# EAGLE design AmbaSat-03-BME680 (EAGLE 9.3.2)
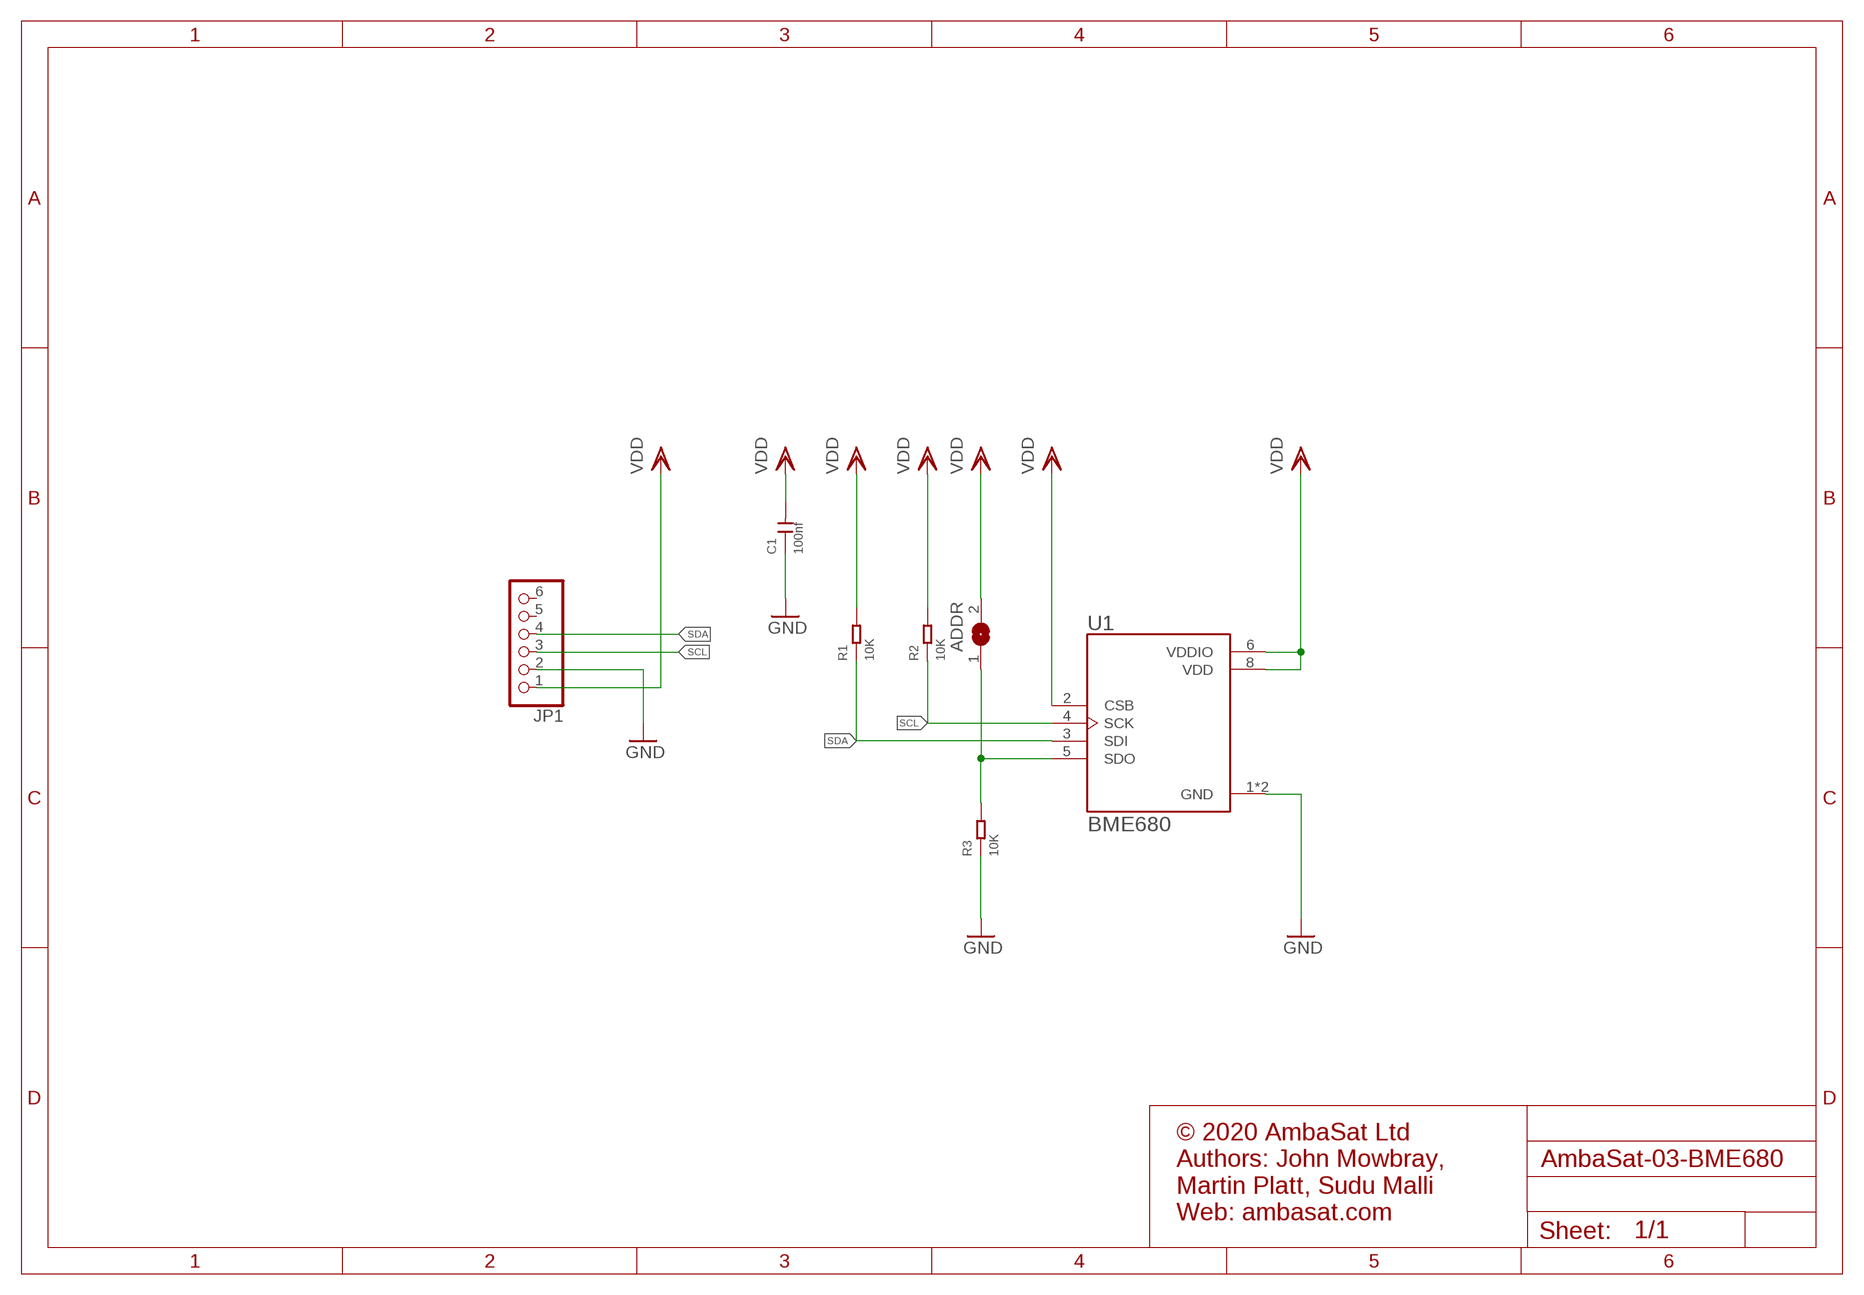
[diagram p0: schematic, sheet 1]

## Parts
ADDR  SJ  [SJ]
C1  100nf  CERAMIC-100NF-50V-10%-X7R(0805)  [C0805]
JP1  HEADER-1X6  [1X06_OVAL]
R1  10K  SMD-RES-10K-1%-1/8W(0805)  [R0805]
R2  10K  SMD-RES-10K-1%-1/8W(0805)  [R0805]
R3  10K  SMD-RES-10K-1%-1/8W(0805)  [R0805]
U1  BME680  [PSON80P300X300X100-8N]

## Nets
GND: C1.1 JP1.2 R3.1 U1.1(GND) U1.7(GND)
N$3: ADDR.1 R3.2 U1.5(SDO)
SCL: JP1.3 R2.1 U1.4(SCK)
SDA: JP1.4 R1.1 U1.3(SDI)
VDD: ADDR.2 C1.2 JP1.1 R1.2 R2.2 U1.2(CSB) U1.6(VDDIO) U1.8(VDD)
Unconnected: JP1.5 JP1.6

## Notes on the sheet
- © 2020 AmbaSat Ltd
  Authors: John Mowbray, 
  Martin Platt, Sudu Malli
  Web: ambasat.com

## Library data of the parts
ADDR = jumper:SJ: SMD solder JUMPER
C1 = Seeed-Capacitor:CERAMIC-100NF-50V-10%-X7R(0805): 302010165; MPN: CC0805KRX7R9BB104
JP1 = microbuilder:HEADER-1X6: PIN HEADER
R1-R3 = Seeed-Resistor:SMD-RES-10K-1%-1/8W(0805): 301010361; MPN: RC0805FR-0710KL
U1 = BME680:BME680: Integrated Environmental Unit; AVAILABILITY: Unavailable; DESCRIPTION: Integrated Environmental Unit; MF: Bosch Sensortec; MP: BME680; PACKAGE: LGA-8 Bosch Tools; PRICE: None

## Board
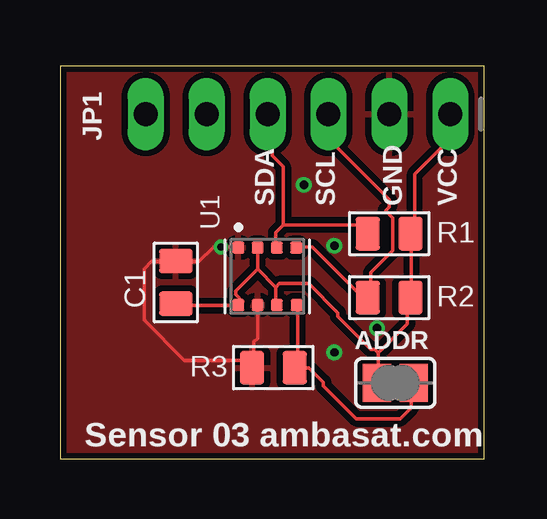
[diagram p1: board, top side]
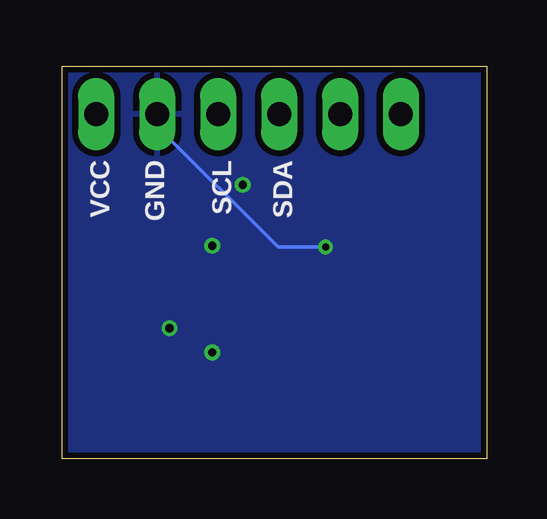
[diagram p2: board, bottom side, seen from below]

Size 17.68 x 16.38 mm. Coordinates in mm from the lower left corner, seen from the top.
Outline: 0,0 17.68,0 17.68,16.38 0,16.38 0,0
Copper layers (1*16): Top 0.035mm / dielectric 1.5mm / Bottom 0.035mm
Design rules "SeeedStudio_2layer_DRU_no_angle_20140221": minimum track width 6mil, minimum drill 12mil, track to track 6mil, track to pad 6mil, pad to pad 6mil, via to via 6mil, smd to smd 0mil, copper to edge 10mil, drill to drill 10mil, minimum pad ring 10mil, minimum via ring 6mil, stop-mask expansion 2mil, vias tented up to drill 100mil, thermal gap 10mil

### Footprints (pad centres in the part's own frame; a part is rotated, then mirrored left to right if it is on the bottom)
SJ = smd 1.168 x 1.6: 1 -0.762,0; 2 0.762,0
C0805 = smd 1.397 x 1.016: 1 0,0.889; 2 0,-0.889
1X06_OVAL = drill 1 long: 1 -6.35,0; 2 -3.81,0; 3 -1.27,0; 4 1.27,0; 5 3.81,0; 6 6.35,0
R0805 = smd 1.397 x 1.016: 1 0,0.889; 2 0,-0.889
PSON80P300X300X100-8N = smd 0.5 x 0.5: 1 1.2,1.2; 2 1.2,0.4; 3 1.2,-0.4; 4 1.2,-1.2; 5 -1.2,-1.22; 6 -1.2,-0.4; 7 -1.2,0.4; 8 -1.2,1.2

### Placement (x,y rotation side)
ADDR  13.97,3.17 180 top
C1  4.83,7.37 0 top
JP1  9.92,14.38 180 top
R1  13.72,9.4 90 top
R2  13.72,6.73 90 top
R3  8.89,3.81 90 top
U1  8.64,7.62 90 top

### Tracks (layer width: path | path; a pad name or v marks a point on that pad's centre or on a via)
GND  (via drill 0.3, 0.35)
  Top 0.152: U1.1 7.32,8.84 v6.71,8.84 6.4,8.84 5.79,8.23 4.88,8.23 C1.1 4.72,8.23 3.81,8.23 3.5,7.92 3.5,5.79 5.18,4.12 8.08,4.12 | 8.08,4.12 8.08,3.81 R3.1 8.08,4.12 | 8.08,4.12 8.08,4.88 8.23,5.03 8.23,6.4 U1.7
  Bottom 0.152: v6.71,8.84 8.69,8.84 13.72,13.87 13.72,14.33 JP1.2
  other vias: 10.16,11.43 11.43,8.89 11.43,4.45 13.21,5.46
  pour Bottom (isolate 0.254): 0,16.38 0,0 17.68,0 17.68,16.38
  pour Top (isolate 0.254): 0,16.38 0,0 17.68,0 17.68,16.38
N$3
  Top 0.152: 9.91,3.81 9.91,6.4 U1.5 | 9.91,3.81 10.36,3.81 10.97,3.2 10.97,3.05 12.34,1.68 14.17,1.68 14.63,2.13 14.63,3.05 ADDR.1 | 9.91,3.81 R3.2
SCL
  Top 0.152: U1.4 9.91,8.84 10.52,8.84 12.5,6.86 12.8,6.86 R2.1 12.95,6.86 12.95,7.77 13.87,8.69 13.87,10.06 13.56,10.36 13.72,10.52 13.72,10.82 11.28,13.26 11.28,14.33 JP1.3
SDA
  Top 0.152: 9.3,9.75 8.99,9.45 8.99,8.84 U1.3 | 9.3,9.75 12.5,9.75 12.8,9.45 R1.1 | 9.3,9.75 9.3,12.19 8.84,12.65 8.84,12.8 8.69,12.95 8.69,14.33 JP1.4
VDD
  Top 0.152: C1.2 4.88,6.4 7.32,6.4 U1.8 7.47,6.4 7.62,6.55 7.32,6.86 7.32,7.01 8.23,7.92 | 8.23,7.92 8.23,8.69 U1.2 | 8.99,7.16 8.99,6.55 U1.6 | 8.23,7.92 8.99,7.16 | 13.26,4.42 13.26,3.2 ADDR.2 | 13.26,4.42 14.48,5.64 14.48,6.71 R2.2 14.63,6.86 14.63,9.3 R1.2 14.63,9.45 14.78,9.6 14.78,11.89 16.15,13.26 16.15,14.33 JP1.1 | 8.99,7.16 9.14,7.32 10.36,7.32 11.58,6.1 11.58,5.94 12.95,4.57 13.11,4.57 13.26,4.42

### Text on the board
tPlace: SDA | SCL | GND | VCC | Sensor 03 ambasat.com
bPlace: SDA | SCL | GND | VCC